# Altium schematic sheet Network.SchDoc
size A4
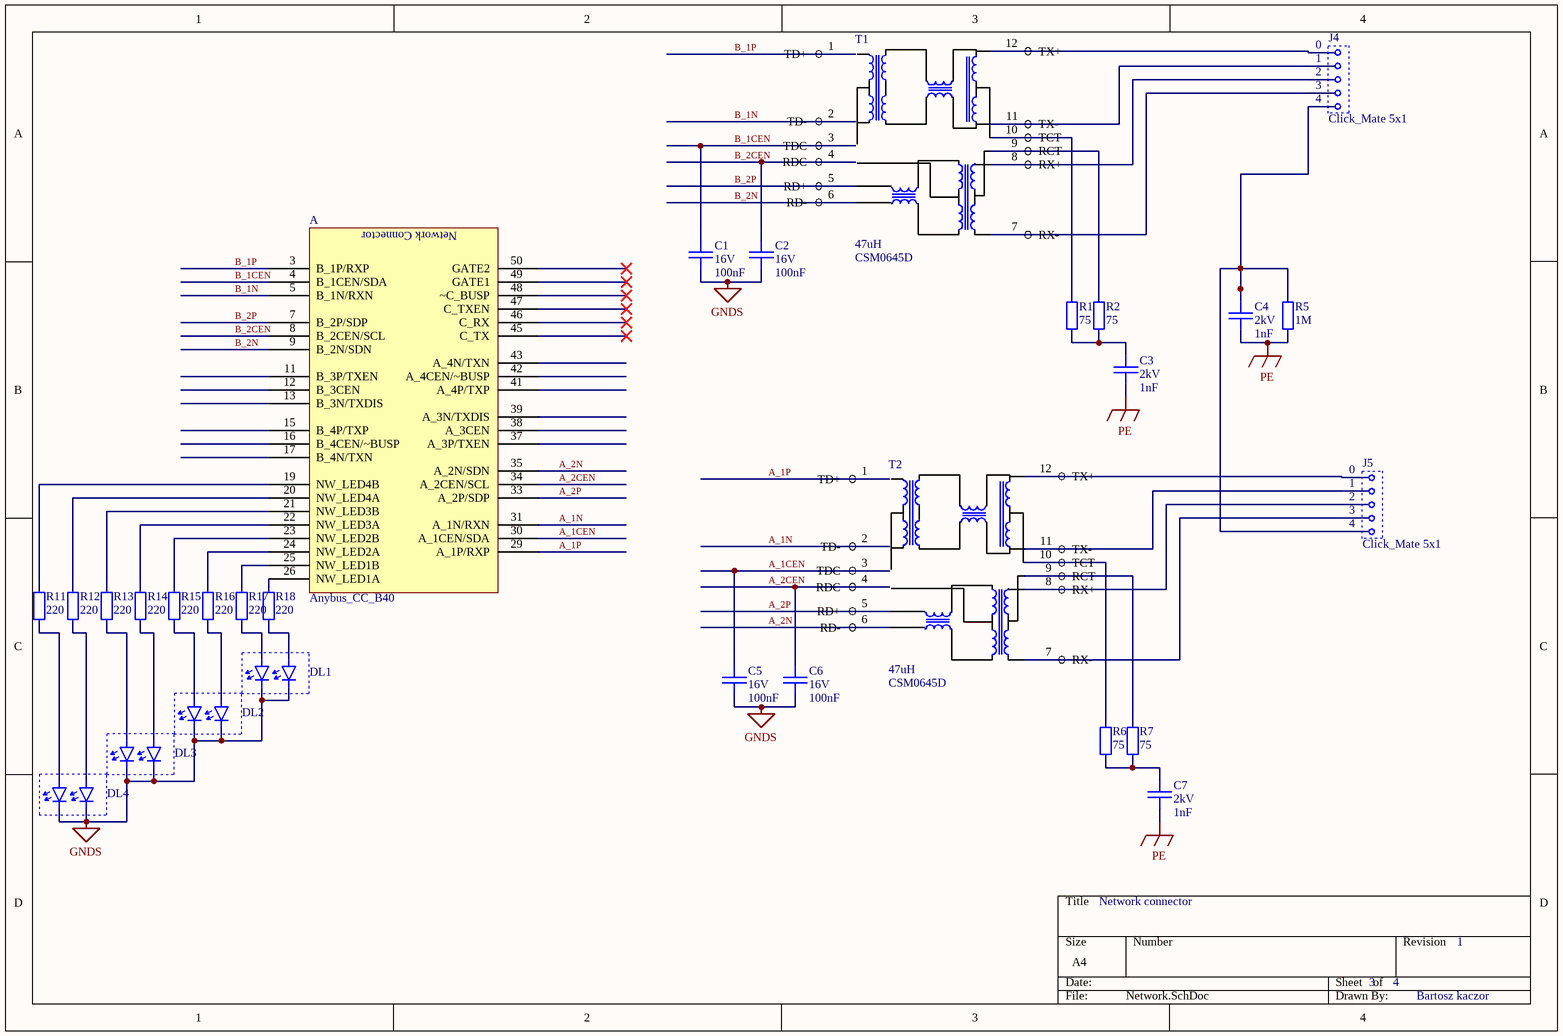
[diagram p0: Network.SchDoc]

## Parts
?  Anybus_CC_B40  [Anybus-CC-B40]  (part A of 3)
C1  value 100nF  Voltage: 16V  [0603 HighDensity]  (hidden comment: 100n)
C2  value 100nF  Voltage: 16V  [0603 HighDensity]  (hidden comment: 100n)
C3  value 1nF  Voltage: 2kV  [0603 HighDensity]  (hidden comment: 100n)
C4  value 1nF  Voltage: 2kV  [0603 HighDensity]  (hidden comment: 100n)
C5  value 100nF  Voltage: 16V  [0603 HighDensity]  (hidden comment: 100n)
C6  value 100nF  Voltage: 16V  [0603 HighDensity]  (hidden comment: 100n)
C7  value 1nF  Voltage: 2kV  [0603 HighDensity]  (hidden comment: 1n)
DL1  LED2  [2D-  3528, PLCC4]  (value not drawn)
DL2  LED2  [2D-  3528, PLCC4]  (value not drawn)
DL3  LED2  [2D-  3528, PLCC4]  (value not drawn)
DL4  LED2  [2D-  3528, PLCC4]  (value not drawn)
J4  Click_Mate 5x1  [CLIK-Mate 5x1]
J5  Click_Mate 5x1  [CLIK-Mate 5x1]
R1  75  [0603_R HighDensity]
R2  75  [0603_R HighDensity]
R5  1M  [0603_R HighDensity]
R6  75  [0603_R HighDensity]
R7  75  [0603_R HighDensity]
R11  220  [0603_R HighDensity]
R12  220  [0603_R HighDensity]
R13  220  [0603_R HighDensity]
R14  220  [0603_R HighDensity]
R15  220  [0603_R HighDensity]
R16  220  [0603_R HighDensity]
R17  220  [0603_R HighDensity]
R18  220  [0603_R HighDensity]
T1  47uH  Symbol: CSM0645D  [H1112]
T2  47uH  Symbol: CSM0645D  [H1112]

## Nets
GNDS: C1.2 C2.2 C5.2 C6.2 DL1.1 DL1.3 DL2.1 DL2.3 DL3.1 DL3.3 DL4.1 DL4.3
PE: C3.2 C4.2 C7.2 R5.1
A_1CEN: ?.30(A_1CEN/SDA) C5.1 T2.3(TDC)
A_1N: ?.31(A_1N/RXN) T2.2(TD-)
A_1P: ?.29(A_1P/RXP) T2.1(TD+)
A_2CEN: ?.34(A_2CEN/SCL) C6.1 T2.4(RDC)
A_2N: ?.35(A_2N/SDN) T2.6(RD-)
A_2P: ?.33(A_2P/SDP) T2.5(RD+)
B_1CEN: ?.4(B_1CEN/SDA) C1.1 T1.3(TDC)
B_1N: ?.5(B_1N/RXN) T1.2(TD-)
B_1P: ?.3(B_1P/RXP) T1.1(TD+)
B_2CEN: ?.8(B_2CEN/SCL) C2.1 T1.4(RDC)
B_2N: ?.9(B_2N/SDN) T1.6(RD-)
B_2P: ?.7(B_2P/SDP) T1.5(RD+)
Net?_19: ?.19(NW_LED4B) R11.2
Net?_20: ?.20(NW_LED4A) R12.2
Net?_21: ?.21(NW_LED3B) R13.2
Net?_22: ?.22(NW_LED3A) R14.2
Net?_23: ?.23(NW_LED2B) R15.2
Net?_24: ?.24(NW_LED2A) R16.2
Net?_25: ?.25(NW_LED1B) R17.2
Net?_26: ?.26(NW_LED1A) R18.2
NetC3_1: C3.1 R1.1 R2.1
NetC4_1: C4.1 J4.4 J5.4 R5.2
NetC7_1: C7.1 R6.1 R7.1
NetDL1_2: DL1.2 R17.1
NetDL1_4: DL1.4 R18.1
NetDL2_2: DL2.2 R15.1
NetDL2_4: DL2.4 R16.1
NetDL3_2: DL3.2 R13.1
NetDL3_4: DL3.4 R14.1
NetDL4_2: DL4.2 R11.1
NetDL4_4: DL4.4 R12.1
NetJ4_0: J4.0 T1.12(TX+)
NetJ4_1: J4.1 T1.11(TX-)
NetJ4_2: J4.2 T1.8(RX+)
NetJ4_3: J4.3 T1.7(RX-)
NetJ5_0: J5.0 T2.12(TX+)
NetJ5_1: J5.1 T2.11(TX-)
NetJ5_2: J5.2 T2.8(RX+)
NetJ5_3: J5.3 T2.7(RX-)
NetR1_2: R1.2 T1.10(TCT)
NetR2_2: R2.2 T1.9(RCT)
NetR6_2: R6.2 T2.10(TCT)
NetR7_2: R7.2 T2.9(RCT)

Not connected (* = marked no-connect by the designer): ? 11(B_3P/TXEN) 12(B_3CEN) 13(B_3N/TXDIS) 15(B_4P/TXP) 16(B_4CEN/~BUSP) 17(B_4N/TXN) 37(A_3P/TXEN) 38(A_3CEN) 39(A_3N/TXDIS) 41(A_4P/TXP) 42(A_4CEN/~BUSP) 43(A_4N/TXN) 45(C_TX)* 46(C_RX)* 47(C_TXEN)* 48(~C_BUSP)* 49(GATE1)* 50(GATE2)*

## Notes on the sheet
- Network connector
- 3      4
- 1
- Bartosz kaczor
- (in symbol Anybus_CC_B40, part A) Network Connector

## Library data of the parts
C1-C7 = C_CER: Ceramic Capacitor
DL1-DL4 = LED2: Light Emitting Diode - Double
R1 R2 R5-R7 R11-R18 = R: Resistor
T1 T2 = H1112-NL-TRANSFORMER: Power Inductor; Supplier: Maritex